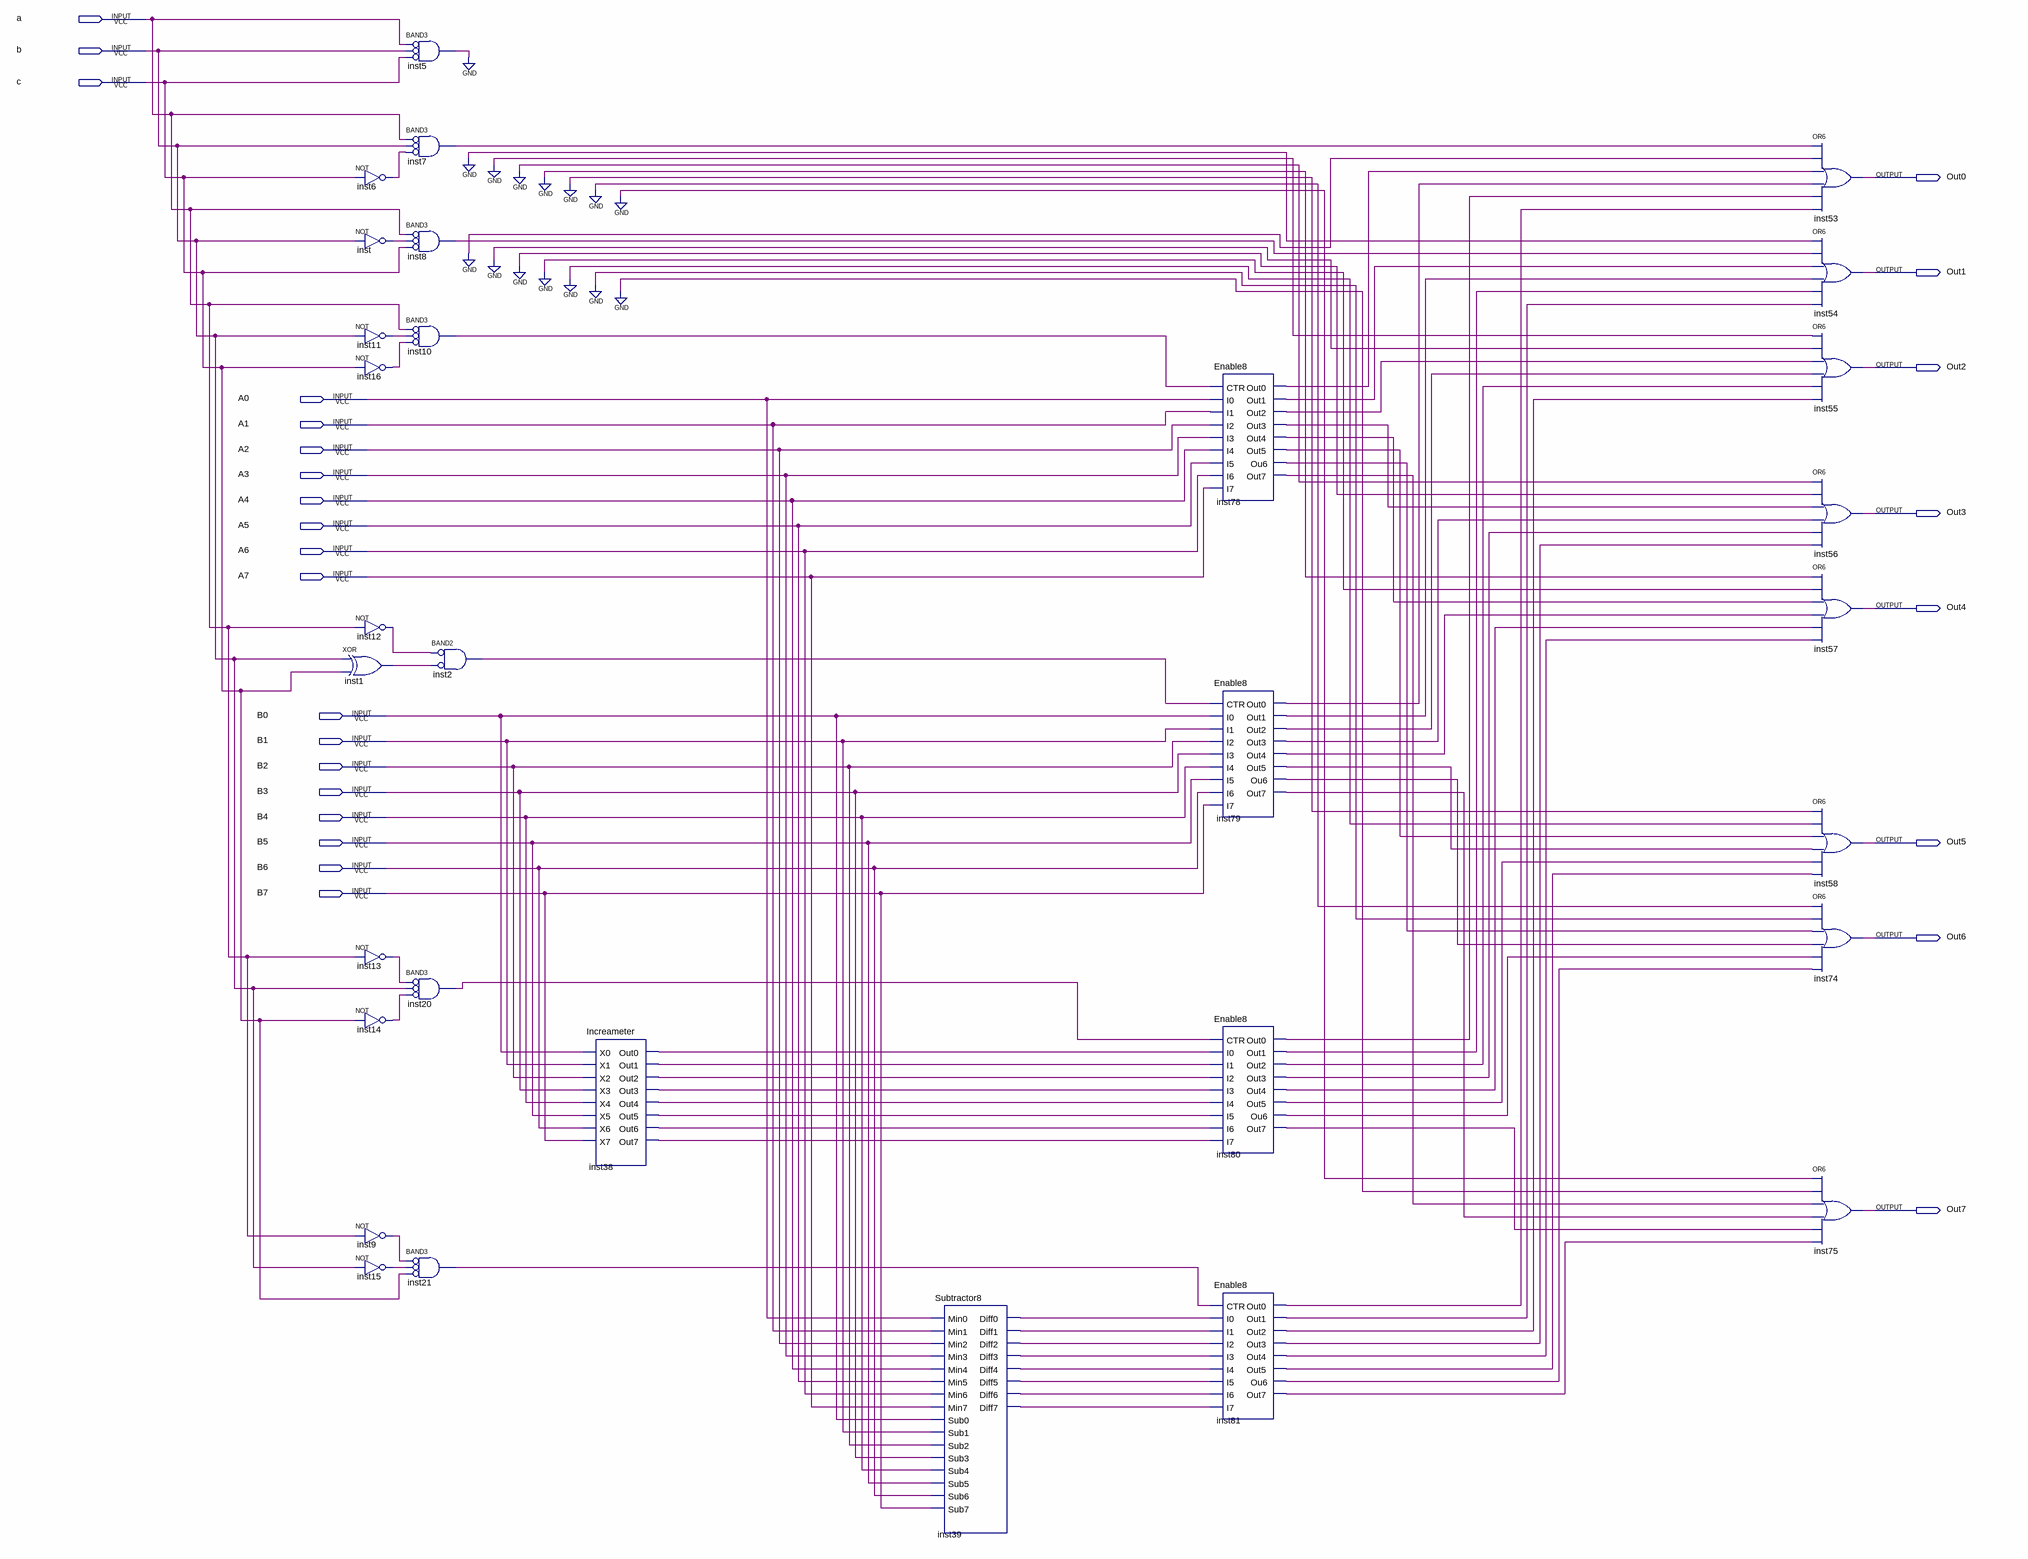
[diagram p0: schematic sheet]
// Quartus schematic ALU.bdf as structural Verilog: 31 symbols, 27 pins
module ALU (
  input  a,
  input  b,
  input  c,
  input  A0,
  input  A1,
  input  A2,
  input  A3,
  input  A4,
  input  A5,
  input  A6,
  input  A7,
  input  B0,
  input  B1,
  input  B2,
  input  B3,
  input  B4,
  input  B5,
  input  B6,
  input  B7,
  output Out0,
  output Out1,
  output Out2,
  output Out3,
  output Out4,
  output Out5,
  output Out6,
  output Out7
);

  wire inst1_out, inst2_out, inst5_out, inst6_out, inst7_out, inst8_out, inst9_out, inst10_out, inst11_out,
       inst12_out, inst13_out, inst14_out, inst15_out, inst16_out, inst20_out, inst21_out, inst38_out0,
       inst38_out1, inst38_out2, inst38_out3, inst38_out4, inst38_out5, inst38_out6, inst38_out7,
       inst39_diff0, inst39_diff1, inst39_diff2, inst39_diff3, inst39_diff4, inst39_diff5, inst39_diff6,
       inst39_diff7, inst78_ou6, inst78_out0, inst78_out1, inst78_out2, inst78_out3, inst78_out4,
       inst78_out5, inst78_out7, inst79_ou6, inst79_out0, inst79_out1, inst79_out2, inst79_out3, inst79_out4,
       inst79_out5, inst79_out7, inst80_ou6, inst80_out0, inst80_out1, inst80_out2, inst80_out3, inst80_out4,
       inst80_out5, inst80_out7, inst81_ou6, inst81_out0, inst81_out1, inst81_out2, inst81_out3, inst81_out4,
       inst81_out5, inst81_out7, inst_out;

  not inst6 (inst6_out, c);
  not inst (inst_out, b);
  not inst11 (inst11_out, b);
  not inst16 (inst16_out, c);
  not inst12 (inst12_out, a);
  xor inst1 (inst1_out, b, c);
  not inst13 (inst13_out, a);
  not inst14 (inst14_out, c);
  not inst9 (inst9_out, a);
  not inst15 (inst15_out, b);
  and inst5 (inst5_out, ~a, ~b, ~c);  // BAND3
  and inst7 (inst7_out, ~a, ~b, ~inst6_out);  // BAND3
  and inst8 (inst8_out, ~a, ~inst_out, ~c);  // BAND3
  and inst10 (inst10_out, ~a, ~inst11_out, ~inst16_out);  // BAND3
  and inst20 (inst20_out, ~inst13_out, ~b, ~inst14_out);  // BAND3
  and inst21 (inst21_out, ~inst9_out, ~inst15_out, ~c);  // BAND3
  and inst2 (inst2_out, ~inst12_out, ~inst1_out);  // BAND2
  Increameter inst38 (
    .X0(B0), .X1(B1), .X2(B2), .X3(B3), .X4(B4), .X5(B5), .X6(B6), .X7(B7), .Out0(inst38_out0),
    .Out1(inst38_out1), .Out2(inst38_out2), .Out3(inst38_out3), .Out4(inst38_out4), .Out5(inst38_out5),
    .Out6(inst38_out6), .Out7(inst38_out7));
  Subtractor8 inst39 (
    .Min0(A0), .Min1(A1), .Min2(A2), .Min3(A3), .Min4(A4), .Min5(A5), .Min6(A6), .Min7(A7), .Sub0(B0),
    .Sub1(B1), .Sub2(B2), .Sub3(B3), .Sub4(B4), .Sub5(B5), .Sub6(B6), .Sub7(B7), .Diff0(inst39_diff0),
    .Diff1(inst39_diff1), .Diff2(inst39_diff2), .Diff3(inst39_diff3), .Diff4(inst39_diff4),
    .Diff5(inst39_diff5), .Diff6(inst39_diff6), .Diff7(inst39_diff7));
  Enable8 inst78 (
    .CTR(inst10_out), .I0(A0), .I1(A1), .I2(A2), .I3(A3), .I4(A4), .I5(A5), .I6(A6), .I7(A7),
    .Out0(inst78_out0), .Out1(inst78_out1), .Out2(inst78_out2), .Out3(inst78_out3), .Out4(inst78_out4),
    .Out5(inst78_out5), .Ou6(inst78_ou6), .Out7(inst78_out7));
  Enable8 inst79 (
    .CTR(inst2_out), .I0(B0), .I1(B1), .I2(B2), .I3(B3), .I4(B4), .I5(B5), .I6(B6), .I7(B7),
    .Out0(inst79_out0), .Out1(inst79_out1), .Out2(inst79_out2), .Out3(inst79_out3), .Out4(inst79_out4),
    .Out5(inst79_out5), .Ou6(inst79_ou6), .Out7(inst79_out7));
  Enable8 inst80 (
    .CTR(inst20_out), .I0(inst38_out0), .I1(inst38_out1), .I2(inst38_out2), .I3(inst38_out3),
    .I4(inst38_out4), .I5(inst38_out5), .I6(inst38_out6), .I7(inst38_out7), .Out0(inst80_out0),
    .Out1(inst80_out1), .Out2(inst80_out2), .Out3(inst80_out3), .Out4(inst80_out4), .Out5(inst80_out5),
    .Ou6(inst80_ou6), .Out7(inst80_out7));
  Enable8 inst81 (
    .CTR(inst21_out), .I0(inst39_diff0), .I1(inst39_diff1), .I2(inst39_diff2), .I3(inst39_diff3),
    .I4(inst39_diff4), .I5(inst39_diff5), .I6(inst39_diff6), .I7(inst39_diff7), .Out0(inst81_out0),
    .Out1(inst81_out1), .Out2(inst81_out2), .Out3(inst81_out3), .Out4(inst81_out4), .Out5(inst81_out5),
    .Ou6(inst81_ou6), .Out7(inst81_out7));
  or inst53 (Out0, inst7_out, 1'b0, inst78_out0, inst79_out0, inst80_out0, inst81_out0);
  or inst54 (Out1, 1'b0, inst8_out, inst78_out1, inst79_out1, inst80_out1, inst81_out1);
  or inst55 (Out2, 1'b0, 1'b0, inst78_out2, inst79_out2, inst80_out2, inst81_out2);
  or inst56 (Out3, 1'b0, 1'b0, inst78_out3, inst79_out3, inst80_out3, inst81_out3);
  or inst57 (Out4, 1'b0, 1'b0, inst78_out4, inst79_out4, inst80_out4, inst81_out4);
  or inst58 (Out5, 1'b0, 1'b0, inst78_out5, inst79_out5, inst80_out5, inst81_out5);
  or inst74 (Out6, 1'b0, 1'b0, inst78_ou6, inst79_ou6, inst80_ou6, inst81_ou6);
  or inst75 (Out7, 1'b0, 1'b0, inst78_out7, inst79_out7, inst80_out7, inst81_out7);
  // also tied to GND on the sheet: inst5_out
endmodule
